# Altium schematic sheet NODEMCU-ESP32-S2.SchDoc
size A3
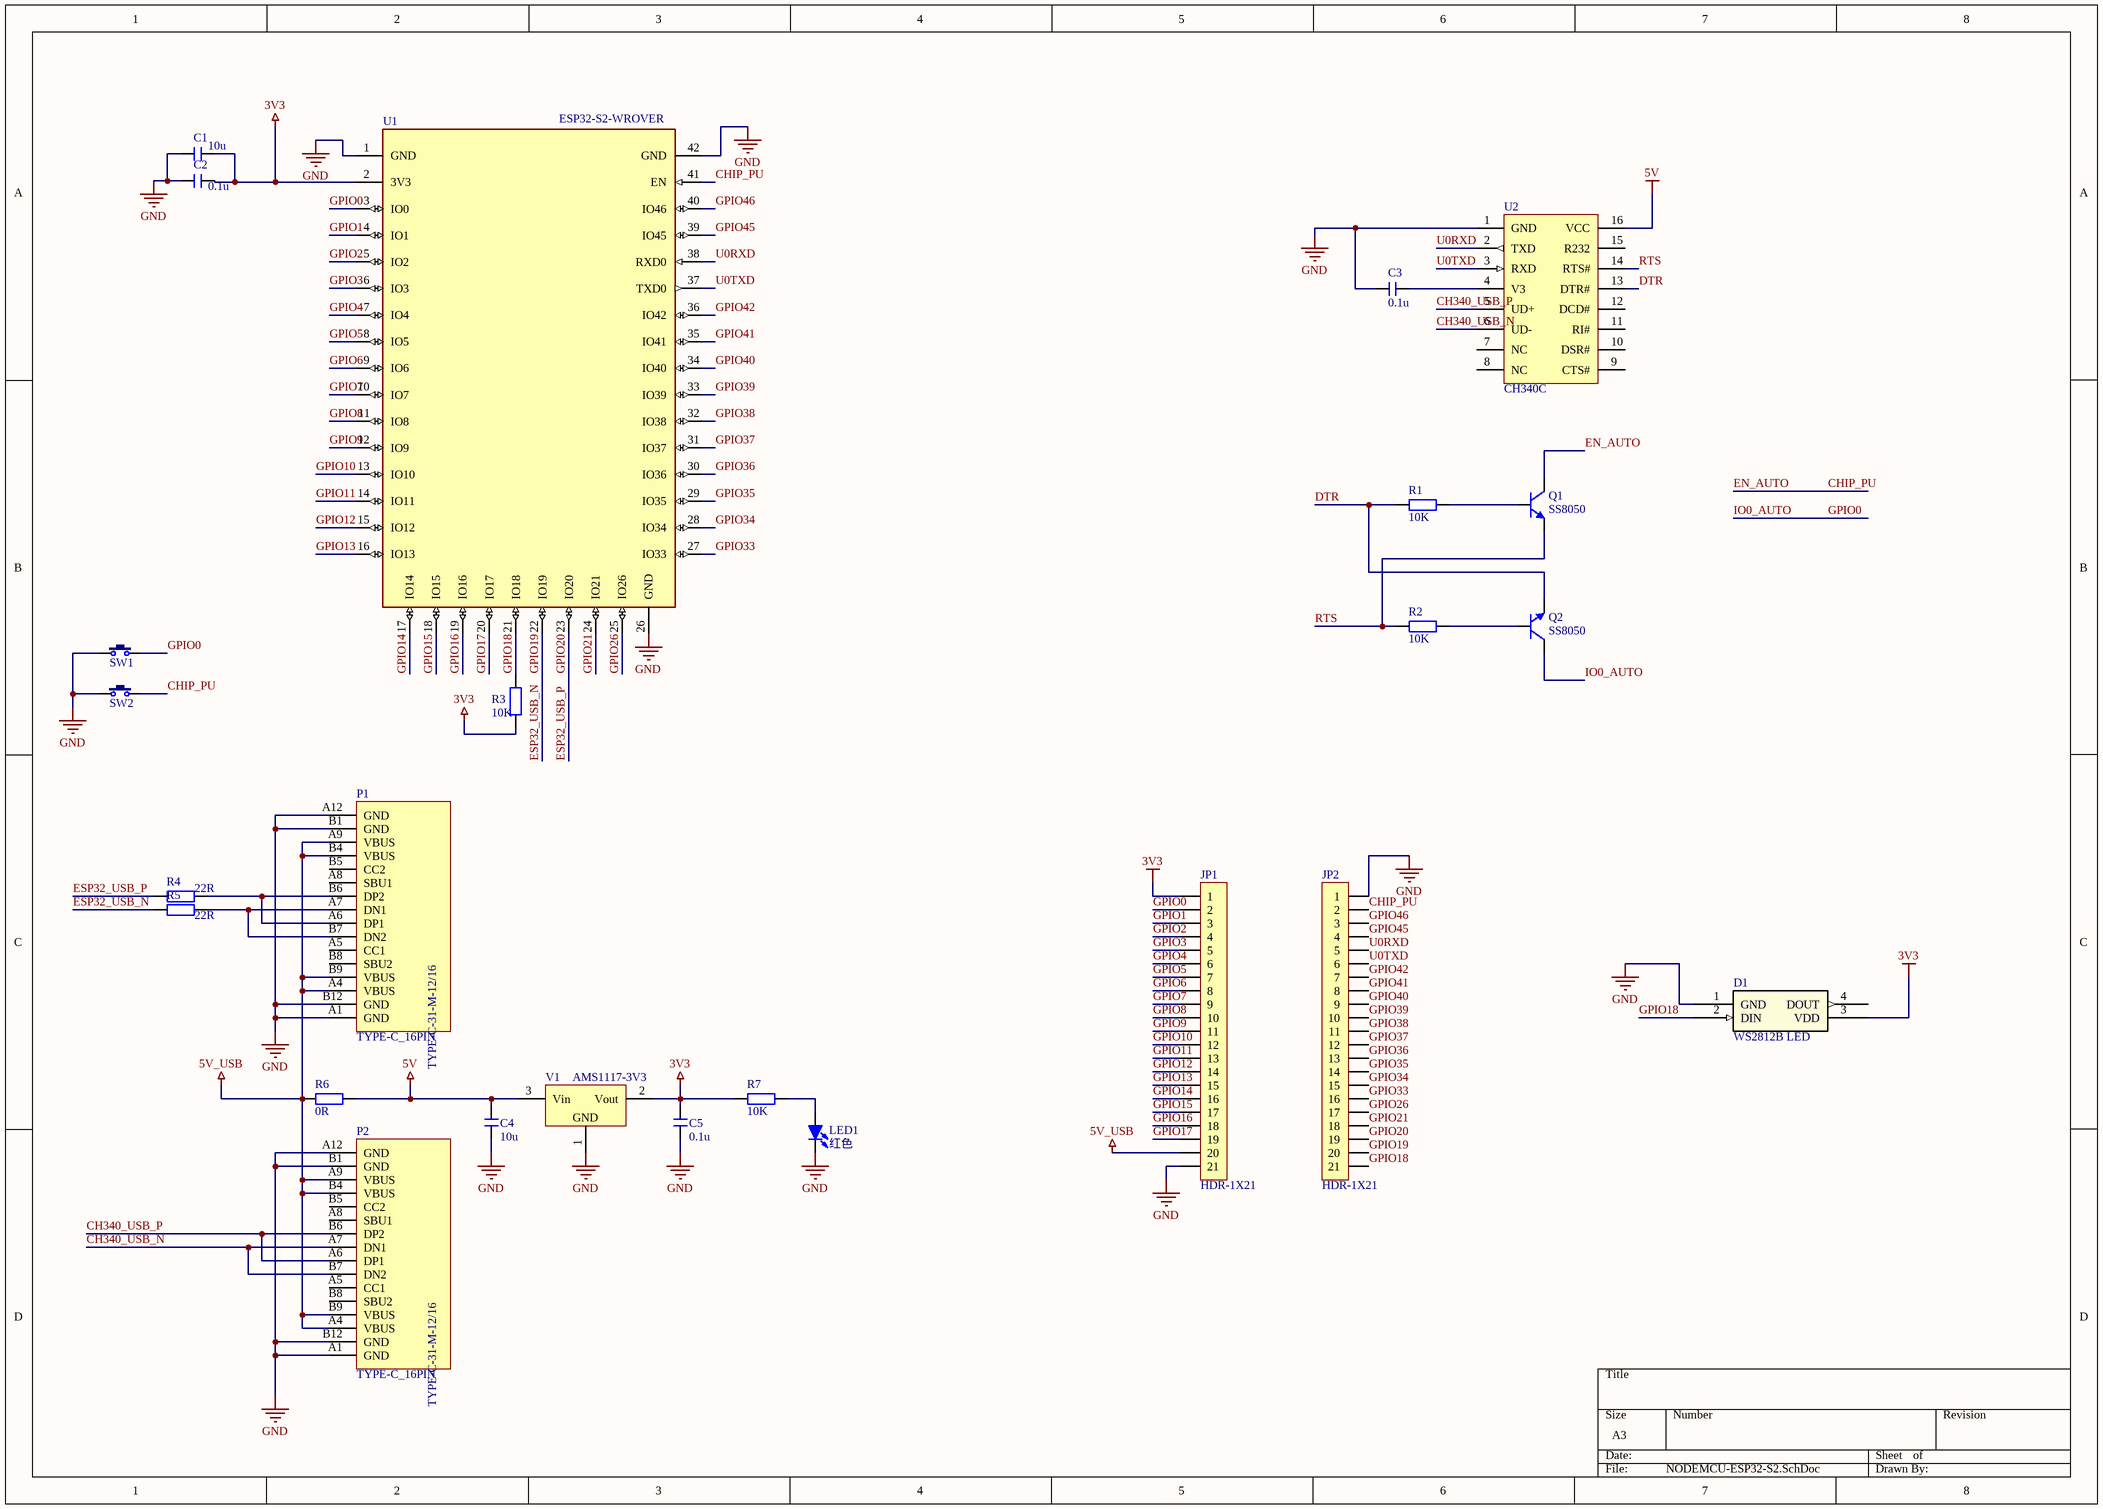
[diagram p0: NODEMCU-ESP32-S2.SchDoc]

## Parts
C1  10u  [C 0603_M]
C2  0.1u  [C 0603_M]
C3  0.1u  [C 0603_M]
C4  10u  [C 0603_M]
C5  0.1u  [C 0603_M]
D1  WS2812B LED  [WS2812B LED]
JP1  HDR-1X21  [HDR2.54-LI-21P]
JP2  HDR-1X21  [HDR2.54-LI-21P]
LED1  红色  [LED 0603R]
P1  TYPE-C_16PIN  [USB-TYPE-C_16PIN]
P2  TYPE-C_16PIN  [USB-TYPE-C_16PIN]
Q1  SS8050  [SOT23-3N]
Q2  SS8050  [SOT23-3N]
R1  10K  [R 0603_M]
R2  10K  [R 0603_M]
R3  10K  [R 0603_M]
R4  22R  [R 0603_M]
R5  22R  [R 0603_M]
R6  0R  [R 0805_M]
R7  10K  [R 0603_M]
SW1  3x6x5  [TSW SMD-3*6*2.5]  (value not drawn)
SW2  3x6x5  [TSW SMD-3*6*2.5]  (value not drawn)
U1  ESP32-S2-WROVER  [MODULE_ESP32-S2-WROVER]
U2  CH340C  [SOP16]
V1  AMS1117-3V3  [SOT223_L]

## Nets
3V3: C1.1 C2.2 C5.2 D1.3(VDD) JP1.1 R3.1 R7.2 U1.2(3V3) V1.2(Vout)
5V: C4.2 R6.2 U2.16(VCC) V1.3(Vin)
5V_USB: JP1.20 P1.A4(VBUS) P1.A9(VBUS) P1.B4(VBUS) P1.B9(VBUS) P2.A4(VBUS) P2.A9(VBUS) P2.B4(VBUS) P2.B9(VBUS) R6.1
GND: C1.2 C2.1 C3.1 C4.1 C5.1 D1.1(GND) JP1.21 JP2.1 LED1.2(K) P1.A1(GND) P1.A12(GND) P1.B1(GND) P1.B12(GND) P2.A1(GND) P2.A12(GND) P2.B1(GND) P2.B12(GND) SW1.1 SW2.1 U1.1(GND) U1.26(GND) U1.42(GND) U2.1(GND) V1.1(GND)
CH340_USB_N: P2.A7(DN1) P2.B7(DN2) U2.6(UD-)
CH340_USB_P: P2.A6(DP1) P2.B6(DP2) U2.5(UD+)
CHIP_PU: JP2.2 Q1.3(C) SW2.2 U1.41(EN)  [also labelled EN_AUTO]
DTR: Q2.2(E) R1.1 U2.13(DTR#)
ESP32_USB_N: JP2.20 R5.1 U1.22(IO19)  [also labelled GPIO19]
ESP32_USB_P: JP2.19 R4.1 U1.23(IO20)  [also labelled GPIO20]
GPIO0: JP1.2 Q2.3(C) SW1.2 U1.3(IO0)  [also labelled IO0_AUTO]
GPIO1: JP1.3 U1.4(IO1)
GPIO2: JP1.4 U1.5(IO2)
GPIO3: JP1.5 U1.6(IO3)
GPIO4: JP1.6 U1.7(IO4)
GPIO5: JP1.7 U1.8(IO5)
GPIO6: JP1.8 U1.9(IO6)
GPIO7: JP1.9 U1.10(IO7)
GPIO8: JP1.10 U1.11(IO8)
GPIO9: JP1.11 U1.12(IO9)
GPIO10: JP1.12 U1.13(IO10)
GPIO11: JP1.13 U1.14(IO11)
GPIO12: JP1.14 U1.15(IO12)
GPIO13: JP1.15 U1.16(IO13)
GPIO14: JP1.16 U1.17(IO14)
GPIO15: JP1.17 U1.18(IO15)
GPIO16: JP1.18 U1.19(IO16)
GPIO17: JP1.19 U1.20(IO17)
GPIO18: D1.2(DIN) JP2.21 R3.2 U1.21(IO18)
GPIO21: JP2.18 U1.24(IO21)
GPIO26: JP2.17 U1.25(IO26)
GPIO33: JP2.16 U1.27(IO33)
GPIO34: JP2.15 U1.28(IO34)
GPIO35: JP2.14 U1.29(IO35)
GPIO36: JP2.13 U1.30(IO36)
GPIO37: JP2.12 U1.31(IO37)
GPIO38: JP2.11 U1.32(IO38)
GPIO39: JP2.10 U1.33(IO39)
GPIO40: JP2.9 U1.34(IO40)
GPIO41: JP2.8 U1.35(IO41)
GPIO42: JP2.7 U1.36(IO42)
GPIO45: JP2.4 U1.39(IO45)
GPIO46: JP2.3 U1.40(IO46)
RTS: Q1.2(E) R2.1 U2.14(RTS#)
U0RXD: JP2.5 U1.38(RXD0) U2.2(TXD)
U0TXD: JP2.6 U1.37(TXD0) U2.3(RXD)
NetC3_2: C3.2 U2.4(V3)
NetLED1_1: LED1.1(A) R7.1
NetP1_A6: P1.A6(DP1) P1.B6(DP2) R4.2
NetP1_A7: P1.A7(DN1) P1.B7(DN2) R5.2
NetQ1_1: Q1.1(B) R1.2
NetQ2_1: Q2.1(B) R2.2

Not connected (* = marked no-connect by the designer): D1 4(DOUT); P1 A5(CC1) A8(SBU1) B5(CC2) B8(SBU2); P2 A5(CC1) A8(SBU1) B5(CC2) B8(SBU2); U2 7(NC) 8(NC) 9(CTS#) 10(DSR#) 11(RI#) 12(DCD#) 15(R232)

## Notes on the sheet
- (in symbol TYPE-C_16PIN) TYPE-C-31-M-12/16

## Library data of the parts
C1-C5 = C: 无极性贴片电容; 版权归属: 源创客; BOM名称: 无极性贴片电容; 学习资源: www.ooocke.com
D1 = WS2812B LED: Imported; Manufacturer: Texas Instruments; GENERIC_PART_NUMBER: OPA690; Manufacturer_Part_Number: opa690_dbv_6; INDUSTRY_STD_PKG_TYPE: SOT-23; FAMILY_NAME: VOLTAGE FEEDBACK; PIN_COUNT: 6; PACKAGE_DESIGNATOR: DBV; Datasheet_URL: http://www.ti.com/lit/gpn/OPA690; Vendor: Texas Instruments; Value: Value; Type: Type; RefDes: RefDes
JP1 JP2 = Header 21: 21P接插件
LED1 = LED-SMD: 贴片LED; 版权归属: 源创客; BOM名称: 贴片LED; 学习资源: www.ooocke.com
Q1 Q2 = 8050-SMD: 高频放大-NPN型; 版权归属: 源创客; 属性: 40V 1.5A 1W 100MHZ; BOM名称: 高频放大-NPN型; 学习资源: www.ooocke.com
R1-R7 = R: 贴片电阻; 版权归属: 源创客; BOM名称: 贴片电阻; 学习资源: www.ooocke.com
SW1 SW2 = TSW 3x6: 3x6轻触开关; 版权归属: 源创客; BOM名称: 3x6轻触开关; 学习资源: www.ooocke.com
U1 = ESP32-S2-WROVER: WiFi 802.11b/g/n, Bluetooth v4.2 + EDR, Class 1, 2 and 3 Transceiver Module 2.4GHz ~ 2.5GHz Integrated, Trace Surface Mount; MF: Espressif Systems; MP: ESP32-WROOM-32D; Price: None; Package: Module Espressif Systems; Availability: Unavailable; SnapEDA_Link: https://www.snapeda.com/parts/ESP32-WROOM-32D/Espressif%20Systems/view-part/2768115/?ref=snap; Value: *
U2 = CH340C: USB转串口 自带时钟; BOM名称: 单路时基芯片; 版权归属: 源创客; 学习资源: www.ooocke.com
V1 = AMS1117: 三端稳压芯片; BOM名称: 稳压芯片; 版权归属: 源创客; 学习资源: www.ooocke.com
P1 P2 = TYPE-C_16PIN: LatestRevisionDate: 17-Jul-2002; LatestRevisionNote: Re-released for DXP Platform.; Publisher: Altium Limited